# EAGLE design CommUplinkv1_18_2_12 (EAGLE 5.10)
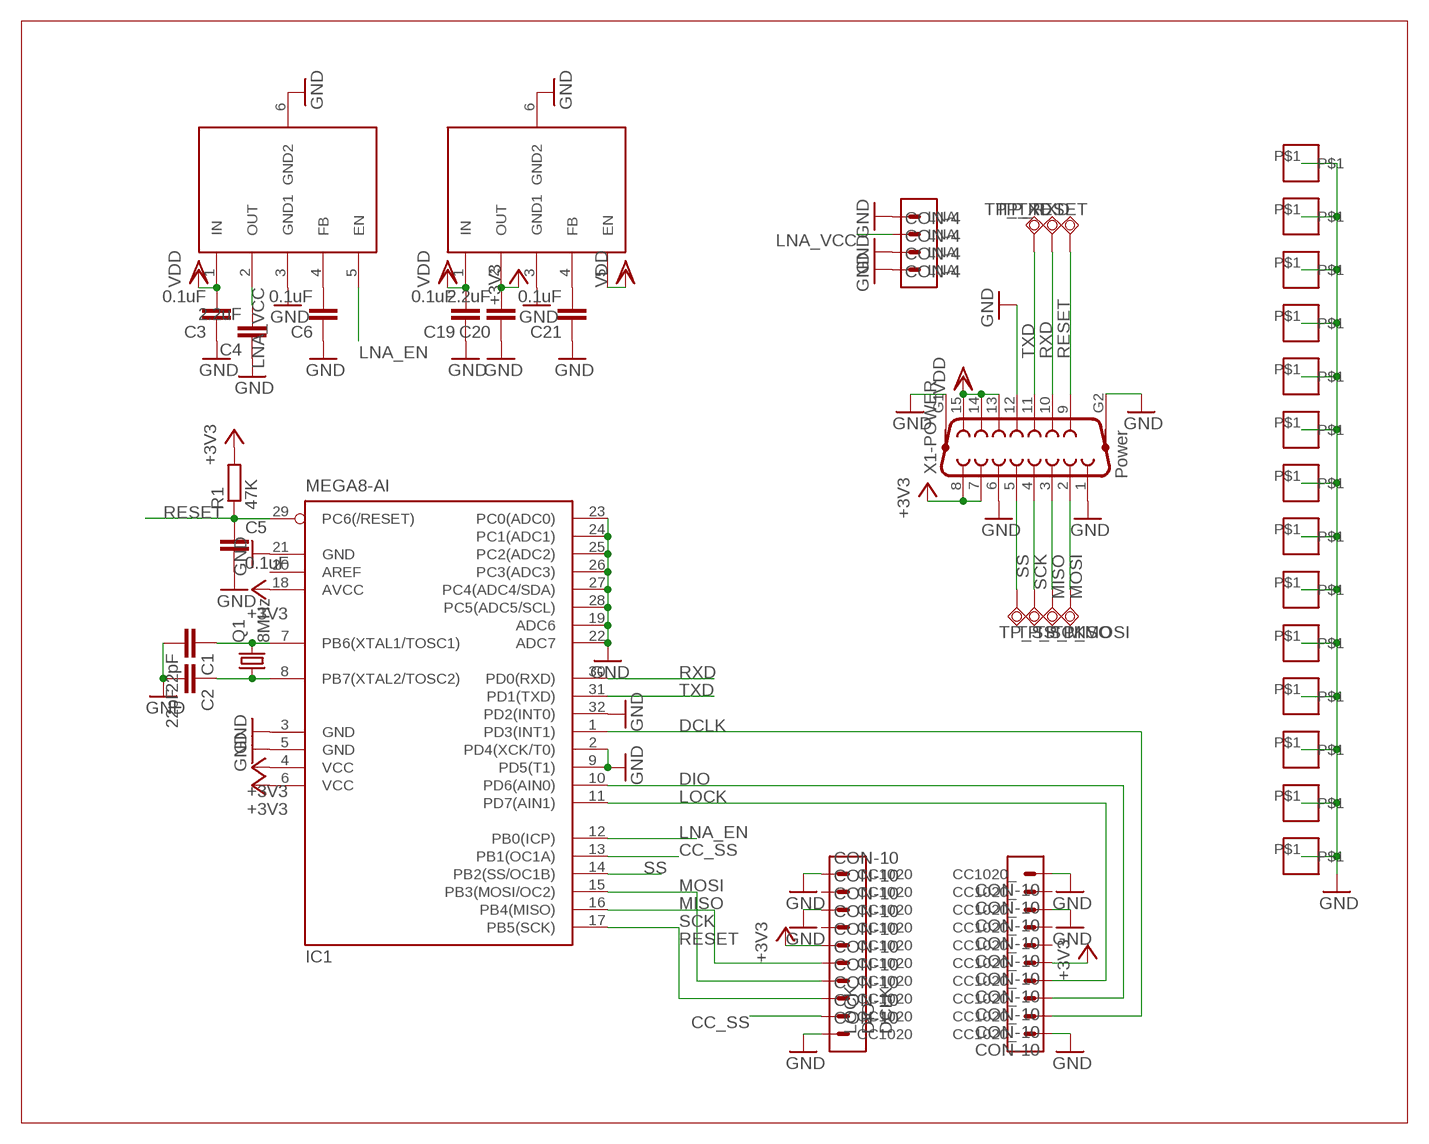
[diagram p0: schematic, sheet 1]

## Parts
C1  22pF  C-EUC1206  [C1206]
C2  22pF  C-EUC1206  [C1206]
C3  0.1uF  C-EUC1206  [C1206]
C4  2.2uF  C-EUC1206  [C1206]
C5  0.1uF  C-EUC1206  [C1206]
C6  0.1uF  C-EUC1206  [C1206]
C19  0.1uF  C-EUC1206  [C1206]
C20  2.2uF  C-EUC1206  [C1206]
C21  0.1uF  C-EUC1206  [C1206]
CC1020  CON-10  [70543-10]
CC1020_  CON-10  [70543-10]
IC1  MEGA8-AI  [TQFP32-08]
IC2  TPS73633  [SOT-223-5]
IC3  TPS73633  [SOT-223-5]
LNA  CON-4  [70543-4]
Q1  8MHz  CRYSTALHC49S  [HC49/S]
R1  47K  R-EU_M1206  [M1206]
TP_MISO  TPSQTP12R  [TP12R]
TP_MOSI  TPSQTP12R  [TP12R]
TP_RESET  TPSQTP12R  [TP12R]
TP_RXD  TPSQTP12R  [TP12R]
TP_SCK  TPSQTP12R  [TP12R]
TP_SS  TPSQTP12R  [TP12R]
TP_TXD  TPSQTP12R  [TP12R]
U$1  MOUNT_SQ  [MOUNT_10MM]
U$2  MOUNT_SQ  [MOUNT_10MM]
U$3  MOUNT_SQ  [MOUNT_10MM]
U$4  MOUNT_SQ  [MOUNT_10MM]
U$5  MOUNT_SQ  [MOUNT_10MM]
U$6  MOUNT_SQ  [MOUNT_10MM]
U$8  MOUNT_SQ  [MOUNT_10MM]
U$9  MOUNT_SQ  [MOUNT_10MM]
U$10  MOUNT_SQ  [MOUNT_10MM]
U$11  MOUNT_SQ  [MOUNT_10MM]
U$12  MOUNT_SQ  [MOUNT_10MM]
U$13  MOUNT_SQ  [MOUNT_10MM]
U$14  MOUNT_SQ  [MOUNT_10MM]
U$15  MOUNT_SQ  [MOUNT_10MM]
X1-POWER  Power  F15HP  [F15HP]

## Nets
+3V3 [Power]: C20.2 CC1020.5(SS5) CC1020_.5(SS5) IC1.4(VCC) IC1.6(VCC) IC1.18(AVCC) IC2.2(OUT) R1.2 X1-POWER.7 X1-POWER.8
CC_SS: CC1020.9(SS9) IC1.13(PB1(OC1A))
DCLK: CC1020_.2(SS2) IC1.1(PD3(INT1))
DIO: CC1020_.3(SS3) IC1.10(PD6(AIN0))
GND [Power]: C1.2 C2.2 C3.1 C4.1 C5.2 C6.1 C19.1 C20.1 C21.1 CC1020.1(SS1) CC1020.3(SS3) CC1020.10(SS10) CC1020_.1(SS1) CC1020_.8(SS8) CC1020_.10(SS10) IC1.2(PD4(XCK/T0)) IC1.3(GND) IC1.5(GND) IC1.9(PD5(T1)) IC1.19(ADC6) IC1.21(GND) IC1.22(ADC7) IC1.23(PC0(ADC0)) IC1.24(PC1(ADC1)) IC1.25(PC2(ADC2)) IC1.26(PC3(ADC3)) IC1.27(PC4(ADC4/SDA)) IC1.28(PC5(ADC5/SCL)) IC1.32(PD2(INT0)) IC2.3(GND1) IC2.6(GND2) IC3.3(GND1) IC3.6(GND2) LNA.1(SS1) LNA.3(SS3) LNA.4(SS4) U$1.P$1 U$2.P$1 U$3.P$1 U$4.P$1 U$5.P$1 U$6.P$1 U$8.P$1 U$9.P$1 U$10.P$1 U$11.P$1 U$12.P$1 U$13.P$1 U$14.P$1 U$15.P$1 X1-POWER.1 X1-POWER.6 X1-POWER.12 X1-POWER.G1 X1-POWER.G2
LNA_EN: IC1.12(PB0(ICP)) IC3.5(EN)
LNA_VCC: C4.2 IC3.2(OUT) LNA.2(SS2)
LOCK: CC1020_.4(SS4) IC1.11(PD7(AIN1))
MISO: CC1020.6(SS6) IC1.16(PB4(MISO)) TP_MISO.TP X1-POWER.3
MOSI: CC1020.7(SS7) IC1.15(PB3(MOSI/OC2)) TP_MOSI.TP X1-POWER.2
N$1: C6.2 IC3.4(FB)
N$7: C21.2 IC2.4(FB)
N$19: C1.1 IC1.7(PB6(XTAL1/TOSC1)) Q1.2
N$20: C2.1 IC1.8(PB7(XTAL2/TOSC2)) Q1.1
RESET: C5.1 IC1.29(PC6(/RESET)) R1.1 TP_RESET.TP X1-POWER.9
RXD: IC1.30(PD0(RXD)) TP_RXD.TP X1-POWER.10
SCK: CC1020.8(SS8) IC1.17(PB5(SCK)) TP_SCK.TP X1-POWER.4
SS: IC1.14(PB2(SS/OC1B)) TP_SS.TP X1-POWER.5
TXD: IC1.31(PD1(TXD)) TP_TXD.TP X1-POWER.11
VDD: C3.2 C19.2 IC2.1(IN) IC2.5(EN) IC3.1(IN) X1-POWER.13 X1-POWER.14 X1-POWER.15
Unconnected: CC1020.2(SS2) CC1020.4(SS4) CC1020_.6(SS6) CC1020_.7(SS7) CC1020_.9(SS9) IC1.20(AREF)

## Library data of the parts
C1-C6 C19-C21 = rcl:C-EU: CAPACITOR, European symbol
CC1020 CC1020_ = satellite:CON-10: CONNECTOR wire to board 2.54 mm (0.100") pitch header
IC1 = atmel:MEGA8: MICROCONTROLLER 8 Kbytes FLASH, 1 kbytes SRAM, 512 bytes EEPROM, USART, 6-channel 10 bit ADC, 2-channel 8 bit ADC Pin compatible with Atmega48, ATMega88, ATMega168 Source: avr.lbr
IC2 IC3 = satellite:TPS73633
LNA = satellite:CON-4: CONNECTOR wire to board 2.54 mm (0.100") pitch header
Q1 = crystal:CRYSTAL: CRYSTAL
R1 = rcl:R-EU_: RESISTOR, European symbol
TP_MISO TP_MOSI TP_RESET TP_RXD TP_SCK TP_SS TP_TXD = testpad:TPSQ: Test pad
U$1-U$6 U$8-U$15 = satellite:MOUNT_SQ
X1-POWER = satellite:F15HP: SUB-D

## Board
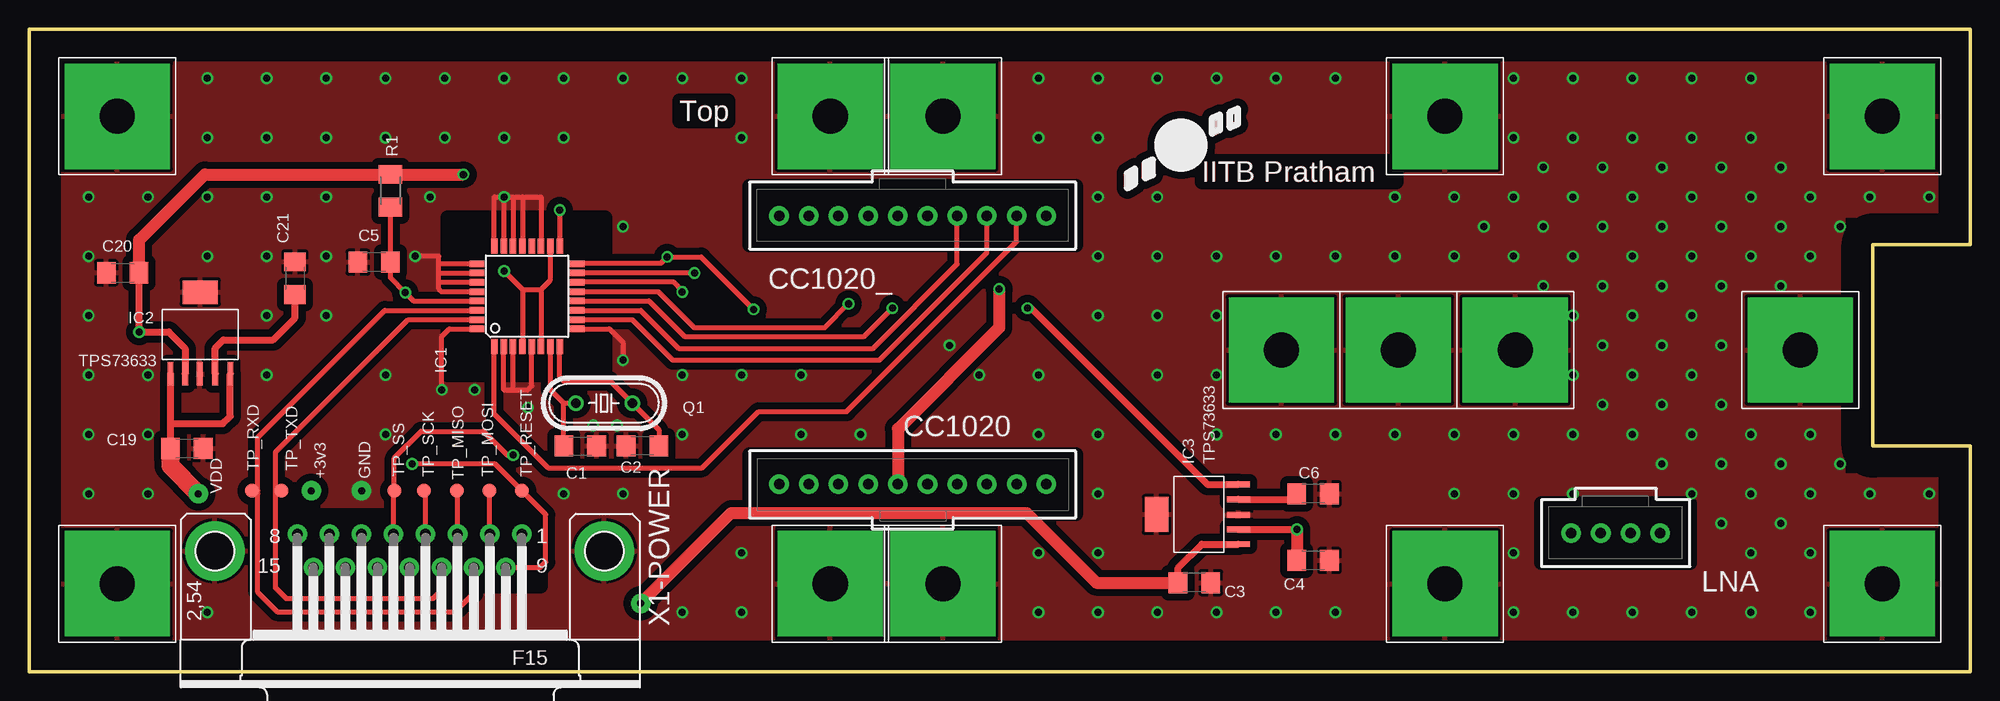
[diagram p1: board, top side]
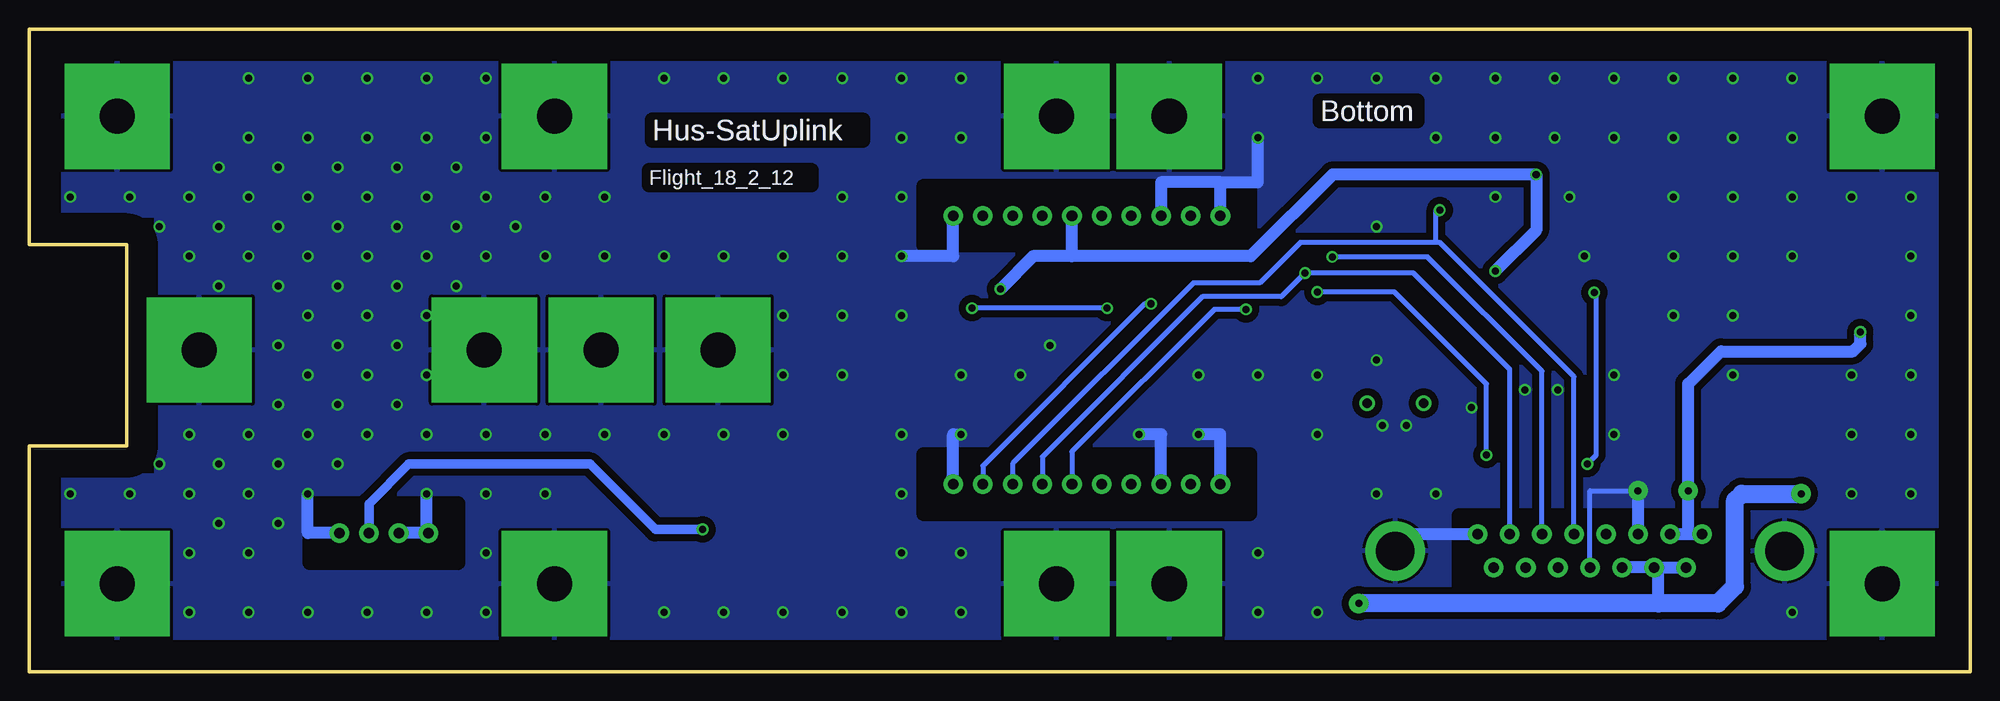
[diagram p2: board, bottom side, seen from below]

Size 166.08 x 55 mm. Coordinates in mm from the lower left corner, seen from the top.
Outline: 0,55 166.08,55 166.08,36.56 157.75,36.56 157.75,19.32 166.08,19.32 166.08,0 0,0 0,55
Copper layers (1*16): Top 0.07mm / dielectric 1.5mm / Bottom 0.07mm
Design rules "satellite": minimum track width 10mil, minimum drill 20mil, track to track 6mil, track to pad 6mil, pad to pad 6mil, via to via 6mil, smd to smd 6mil, copper to edge 100mil, drill to drill 8mil, minimum pad ring 10mil, minimum via ring 8mil, stop-mask expansion 4mil, vias tented up to drill 0mil, thermal gap 10mil
tKeepout: area 54.3,12.5 to 94.7,42.5
tRestrict: area 35.8,25.4 to 49.3,38.9

### Footprints (pad centres in the part's own frame; a part is rotated, then mirrored left to right if it is on the bottom)
C1206 = smd 1.6 x 1.8: 1 -1.4,0; 2 1.4,0
70543-10 = drill 0.9 pad 1.676 round: 1 -11.43,0; 2 -8.89,0; 3 -6.35,0; 4 -3.81,0; 5 -1.27,0; 6 1.27,0; 7 3.81,0; 8 6.35,0; 9 8.89,0; 10 11.43,0
TQFP32-08 = smd 1.27 x 0.559: 1 -4.293,2.8; 2 -4.293,2; 3 -4.293,1.2; 4 -4.293,0.4; 5 -4.293,-0.4; 6 -4.293,-1.2; 7 -4.293,-2; 8 -4.293,-2.8; 17 4.293,-2.8; 18 4.293,-2; 19 4.293,-1.2; 20 4.293,-0.4; 21 4.293,0.4; 22 4.293,1.2; 23 4.293,2; 24 4.293,2.8 | smd 0.559 x 1.27: 9 -2.8,-4.293; 10 -2,-4.293; 11 -1.2,-4.293; 12 -0.4,-4.293; 13 0.4,-4.293; 14 1.2,-4.293; 15 2,-4.293; 16 2.8,-4.293; 25 2.8,4.293; 26 2,4.293; 27 1.2,4.293; 28 0.4,4.293; 29 -0.4,4.293; 30 -1.2,4.293; 31 -2,4.293; 32 -2.8,4.293
SOT-223-5 = smd 0.5 x 2: 1 -2.54,-2.75; 2 -1.29,-2.75; 3 -0.04,-2.75; 4 1.29,-2.75; 5 2.58,-2.75 | smd 3 x 2: 6 0,4.25
70543-4 = drill 0.9 pad 1.676 round: 1 -3.81,0; 2 -1.27,0; 3 1.27,0; 4 3.81,0
HC49/S = drill 0.813 round: 1 -2.413,0; 2 2.413,0
M1206 = smd 1.6 x 2: 1 -1.4,0; 2 1.4,0
TP12R = smd 1.2 x 1.2: TP 0,0
MOUNT_10MM = drill 3 pad 9 square: P$1 0,0
F15HP = drill 0.9 pad 1.676 round: 1 -9.601,-1.422; 2 -6.858,-1.422; 3 -4.115,-1.422; 4 -1.372,-1.422; 5 1.372,-1.422; 6 4.115,-1.422; 7 6.858,-1.422; 8 9.601,-1.422; 9 -8.23,1.422; 10 -5.486,1.422; 11 -2.743,1.422; 12 0,1.422; 13 2.743,1.422; 14 5.486,1.422; 15 8.23,1.422 | drill 3.302 pad 5.08 round: G1 16.662,0; G2 -16.662,0

### Placement (x,y rotation side)
C1  47.14,19.33 0 top
C2  52.48,19.33 180 top
C3  99.7,7.62 180 top
C4  109.86,9.53 180 top
C5  29.51,35.05 180 top
C6  109.86,15.24 180 top
C19  13.49,19.1 180 top
C20  8,34.15 0 top
C21  22.73,33.69 270 top
CC1020  75.59,16.04 0 top
CC1020_  75.59,39.04 180 top
IC1  42.6,32.14 90 top
IC2  14.63,28.24 0 top
IC3  100.71,13.46 90 top
LNA  135.74,11.87 180 top
Q1  49.17,22.99 180 top
R1  30.91,41.17 90 top
TP_MISO  36.58,15.49 0 top
TP_MOSI  39.37,15.49 0 top
TP_RESET  42.16,15.49 0 top
TP_RXD  19.05,15.49 0 top
TP_SCK  33.78,15.49 0 top
TP_SS  31.24,15.49 0 top
TP_TXD  21.59,15.49 0 top
U$1  158.54,47.54 0 top
U$2  158.54,7.54 0 top
U$3  7.54,47.54 0 top
U$4  7.54,7.54 0 top
U$5  151.54,27.54 180 top
U$6  127.14,27.54 180 top
U$8  117.14,27.54 0 top
U$9  68.54,7.54 0 top
U$10  68.54,47.54 0 top
U$11  78.17,7.54 0 top
U$12  78.17,47.54 0 top
U$13  107.14,27.54 0 top
U$14  121.14,47.54 0 top
U$15  121.14,7.54 0 top
X1-POWER  32.54,10.34 180 top

### Tracks (layer width: path | path; a pad name or v marks a point on that pad's centre or on a via)
+3V3  (via drill 0.6, 0.6 pad 0.61, 0.6 pad 1.02, 0.6 pad 1.68)
  Top 0.406: IC2.2 | v40.64,34.29 42.2,32.73 | 42.2,32.73 IC1.4 | 42.2,32.73 43.8,32.73 | 43.8,32.73 IC1.6 | IC1.18 44.6,33.53 43.8,32.73
  Top 0.61: IC2.2 13.34,27.69 11.94,29.08 v9.4,29.08 C20.2
  Top 1.016: C20.2 9.4,36.96 15.01,42.57 R1.2 v37.15,42.57 | CC1020.5 74.32,20.79 82.99,29.46 v82.99,32.77
  Bottom 1.016: 76.86,35.56 CC1020_.5 | 76.86,35.56 61.56,35.56 54.55,42.57 v37.15,42.57 37.15,37.78 v40.64,34.29 | v82.99,32.77 80.2,35.56 76.86,35.56 | v9.4,29.08 9.4,28.06 10.03,27.43 21.34,27.43 24.13,24.64 v24.13,15.49 24.13,11.76 | X1-POWER.8 24.13,11.76 | 24.13,11.76 X1-POWER.7
CC_SS  (via drill 0.6)
  Top 0.406: IC1.13 53.82,32.54 56.9,29.46 68.07,29.46 v70.1,31.5
  Bottom 0.406: v70.1,31.5 70.61,31.5 84.48,17.63 CC1020.9
DCLK
  Top 0.406: CC1020_.2 84.48,36.82 69.94,22.28 62.41,22.28 57.58,17.45 44.39,17.45 39.8,22.04 IC1.1
DIO
  Top 0.406: IC1.10 51.59,30.14 55.05,26.67 72.75,26.67 81.94,35.87 CC1020_.3
GND  (via drill 0.6, 0.6 pad 1.68)
  Top 0.406: 42.2,40.64 IC1.21 | 41.4,40.64 42.2,40.64 | 41.4,40.64 v40.64,40.64 40.6,40.64 | IC1.19 43.8,40.64 42.2,40.64 | IC1.28 35.28,32.54 35.05,32.77 35.05,33.34 | IC1.22 41.4,40.64 | 40.6,40.64 IC1.23 | IC1.24 39.8,40.64 40.6,40.64 | 35.05,34.94 IC1.25 | 35.05,34.14 IC1.26 | 35.05,34.14 35.05,34.94 | 35.05,33.34 IC1.27 | 35.05,33.34 35.05,34.14 | IC1.9 49.66,29.34 50.8,28.19 v50.8,26.67 | IC1.32 35.94,29.34 35.31,28.7 v35.31,24.13 | IC1.2 40.6,24.13 41.4,24.13 | 41.4,24.13 IC1.3 | IC1.5 43,24.45 42.67,24.13 41.4,24.13 | 35.05,34.94 35.05,35.56 v33.02,35.56
  Bottom 0.406: X1-POWER.12 32.54,15.49 v28.43,15.49
  Bottom 1.016: LNA.3 LNA.4 132.08,11.87 v132.08,15.24 | CC1020_.10 64.16,41.91 | CC1020_.8 69.24,41.91 64.16,41.91 | CC1020.3 69.24,20.32 v71.12,20.32 | CC1020.10 87.02,20.32 v86.36,20.32 | CC1020_.1 87.02,35.56 v91.44,35.56 | v28.43,15.49 X1-POWER.6 | LNA.1 142.24,11.87 v142.24,15.24 | 64.16,41.91 60.96,41.91 v60.96,45.72 | CC1020.1 64.16,20.32 v66.04,20.32 | X1-POWER.1 47.78,11.76 X1-POWER.G2
  other vias: 5.08,15.24 10.16,15.24 10.16,20.32 10.16,25.4 5.08,25.4 5.08,20.32 5.08,30.48 5.08,35.56 5.08,40.64 10.16,40.64 15.24,45.72 15.24,50.8 20.32,50.8 25.4,50.8 25.4,45.72 20.32,45.72 30.48,45.72 35.56,45.72 40.64,45.72 30.48,50.8 35.56,50.8 40.64,50.8 45.72,50.8 50.8,50.8 55.88,50.8 60.96,50.8 20.32,40.64 25.4,40.64 34.29,40.64 25.4,35.56 15.24,35.56 25.4,30.48 20.32,25.4 30.48,25.4 30.48,20.32 15.24,5.08 45.72,15.24 50.8,15.24 55.88,5.08 60.96,5.08 55.88,20.32 55.88,25.4 60.96,25.4 66.04,25.4 50.8,38.1 86.36,50.8 91.44,50.8 96.52,50.8 101.6,50.8 106.68,50.8 111.76,50.8 127,50.8 132.08,50.8 137.16,50.8 142.24,50.8 147.32,50.8 127,45.72 132.08,45.72 86.36,45.72 96.52,25.4 116.84,35.56 121.92,35.56 127,35.56 132.08,35.56 137.16,35.56 142.24,35.56 147.32,35.56 152.4,35.56 152.4,40.64 157.48,40.64 162.56,40.64 162.56,15.24 157.48,15.24 152.4,15.24 152.4,20.32 147.32,20.32 142.24,20.32 142.24,25.4 142.24,30.48 137.16,30.48 137.16,25.4 137.16,20.32 132.08,40.64 147.32,15.24 116.84,40.64 132.08,20.32 127,15.24 121.92,15.24 101.6,20.32 106.68,20.32 111.76,20.32 116.84,20.32 121.92,20.32 127,20.32 152.4,10.16 152.4,5.08 147.32,5.08 147.32,10.16 147.32,40.64 142.24,5.08 137.16,5.08 132.08,5.08 127,5.08 127,10.16 86.36,5.08 86.36,10.16 91.44,20.32 91.44,30.48 86.36,25.4 78.74,27.94 60.96,10.16 38.1,24.13 42.67,22.61 132.08,30.48 132.08,25.4 129.54,38.1 134.62,38.1 139.7,38.1 144.78,38.1 149.86,38.1 154.94,38.1 144.78,33.02 139.7,33.02 134.62,33.02 129.54,33.02 149.86,33.02 144.78,27.94 144.78,22.86 139.7,22.86 139.7,27.94 134.62,27.94 134.62,22.86 121.92,40.64 139.7,17.78 144.78,17.78 149.86,17.78 144.78,12.7 149.86,12.7 154.94,17.78 124.46,38.1 129.54,43.18 134.62,43.18 81.28,25.4 127,40.64 137.16,40.64 142.24,40.64 149.86,43.18 144.78,43.18 139.7,43.18 137.16,45.72 142.24,45.72 147.32,45.72 101.6,30.48 101.6,25.4 111.76,35.56 96.52,30.48 111.76,5.08 91.44,10.16 91.44,40.64 96.52,35.56 101.6,35.56 106.68,35.56 91.44,45.72 91.44,5.08 96.52,5.08 101.6,5.08 106.68,5.08 91.44,15.24 96.52,40.64 45.72,45.72 15.24,40.64 20.32,35.56 20.32,30.48 48.26,21.08 50.29,21.08
  pour Bottom (isolate 0.61): 2.54,2.54 2.54,52.54 163.54,52.54 163.54,39.1 155.21,39.1 155.21,16.78 163.54,16.78 163.54,2.54
  pour Top (isolate 0.61): 2.54,2.54 163.54,2.54 163.54,16.78 155.21,16.78 155.21,39.1 163.54,39.1 163.54,52.54 2.54,52.54
LNA_EN  (via drill 0.6)
  Top 0.406: v73.85,31.11 71.44,28.7 56.07,28.7 53.03,31.74 IC1.12
  Top 0.61: IC3.5 100.8,16.04 85.73,31.11 v85.41,31.11
  Bottom 0.406: v73.85,31.11 v85.41,31.11
LNA_VCC  (via drill 0.6 pad 1.02)
  Top 0.61: IC3.2 v108.46,12.17
  Top 1.016: v108.46,12.17 C4.2
  Bottom 0.813: LNA.2 137.01,14.37 133.6,17.78 118.11,17.78 112.5,12.17 v108.46,12.17
LOCK
  Top 0.406: IC1.11 52.31,30.94 55.56,27.69 72.2,27.69 79.4,34.89 CC1020_.4
MISO  (via drill 0.6 pad 0.41)
  Top 0.406: IC1.16 54.04,34.95 v54.6,35.51 57.49,35.51 v61.98,31.02 | X1-POWER.3 36.66,15.49 TP_MISO.TP
  Bottom 0.406: v54.6,35.51 46.43,35.51 36.66,25.73 X1-POWER.3 | CC1020.6 76.86,18.84 64.68,31.02 v61.98,31.02
MOSI  (via drill 0.6 pad 0.41)
  Top 0.406: IC1.15 v56.91,34.14 | X1-POWER.2 39.4,15.49 TP_MOSI.TP
  Bottom 0.406: CC1020.7 79.4,18.4 65.7,32.1 58.94,32.1 v56.91,34.14 47.65,34.14 39.4,25.88 X1-POWER.2
N$1
  Top 0.61: IC3.4 108.46,14.75 C6.2
N$2
  Top 0.61: 95.48,43.54 96.11,43.81 96.11,42.55 95.48,42.27 95.48,43.54
N$3
  Top 0.61: 93.96,42.67 94.59,43.05 94.59,41.78 93.96,41.4 93.96,42.67
N$4
  Top 0.61: 101.22,47.37 101.85,47.65 101.85,46.38 101.22,46.1 101.22,47.37
N$5
  Top 0.61: 103.38,48.16 102.74,47.88 102.74,46.61 103.38,46.89
N$7
  Top 0.61: IC2.4 15.92,27.71 16.61,28.4 20.85,28.4 22.73,30.28 C21.2
N$19
  Top 0.406: C1.1 45.74,22.98 | 45.74,22.98 Q1.2 | IC1.7 44.6,24.13 45.74,22.98
N$20
  Top 0.406: C2.1 53.88,20.7 Q1.1 49.68,24.89 45.72,24.89 45.4,25.22 IC1.8
RESET  (via drill 0.6, 0.6 pad 0.41)
  Top 0.406: R1.1 C5.1 30.91,33.73 v32.18,32.46 32.9,31.74 IC1.29 | v32.77,17.78 39.88,17.78 TP_RESET.TP 44.2,13.46 44.2,9.4 43.72,8.92 X1-POWER.9
  Bottom 0.406: v32.77,17.78 32,18.54 32,32.28 v32.18,32.46
RXD
  Top 0.406: IC1.30 30.43,30.94 19.56,20.07 19.56,15.49 | X1-POWER.10 38.03,6.71 36.45,5.13 21.21,5.13 19.56,6.78 19.56,15.24 19.56,15.49 | 19.56,15.49 TP_RXD.TP
SCK  (via drill 0.6)
  Top 0.406: IC1.17 v45.4,39.51 | X1-POWER.4 33.91,15.49 TP_SCK.TP
  Bottom 0.406: CC1020.8 81.94,17.82 66.48,33.27 60.78,33.27 57.32,36.74 45.72,36.74 | X1-POWER.4 33.91,25.27 45.39,36.74 45.72,36.74 | v45.4,39.51 45.72,39.51 45.72,36.74
SS  (via drill 0.6)
  Top 0.406: IC1.14 55.17,33.34 55.88,32.62 v55.88,32.51 | X1-POWER.5 31.17,15.49 TP_SS.TP 31.24,18.29 33.53,20.57 38.86,20.57 40.89,18.54 v41.4,18.54
  Bottom 0.406: v55.88,32.51 49.28,32.51 41.4,24.64 v41.4,18.54
TXD
  Top 0.406: X1-POWER.11 35.28,7.01 34.54,6.27 21.97,6.27 21.08,7.16 21.08,15.24 21.08,15.49 | IC1.31 32.42,30.14 21.08,18.8 21.08,15.49 | 21.08,15.49 TP_TXD.TP
VDD  (via drill 0.6 pad 1.68)
  Top 0.61: IC2.5 17.21,21.87 16.57,21.23 12.09,21.23 | IC3.1 100.33,10.92 98.3,8.89 C3.2 | 12.09,21.23 IC2.1 | 12.09,21.23 C19.2
  Top 1.016: v52.32,5.84 60.07,13.59 85.34,13.59 91.31,7.62 C3.2
  Top 1.524: v14.48,15.24 12.09,17.63 C19.2
  Bottom 1.016: 26.67,8.92 X1-POWER.14 X1-POWER.13 | 26.67,5.84 26.67,8.92 | 26.67,8.92 X1-POWER.15
  Bottom 1.524: v52.32,5.84 26.67,5.84 21.59,5.84 20.13,7.3 20.13,14.67 19.56,15.24 v14.48,15.24
(copper drawn outside any net)
  shapes: Top circle x1

### Text on the board
Top: Top | IITB Pratham
Bottom: Bottom | Hus-SatUplink | Flight_18_2_12
tPlace: Top | IITB Pratham
bPlace: Bottom | Hus-SatUplink | Flight_18_2_12
tNames: +3v3 | GND | VDD